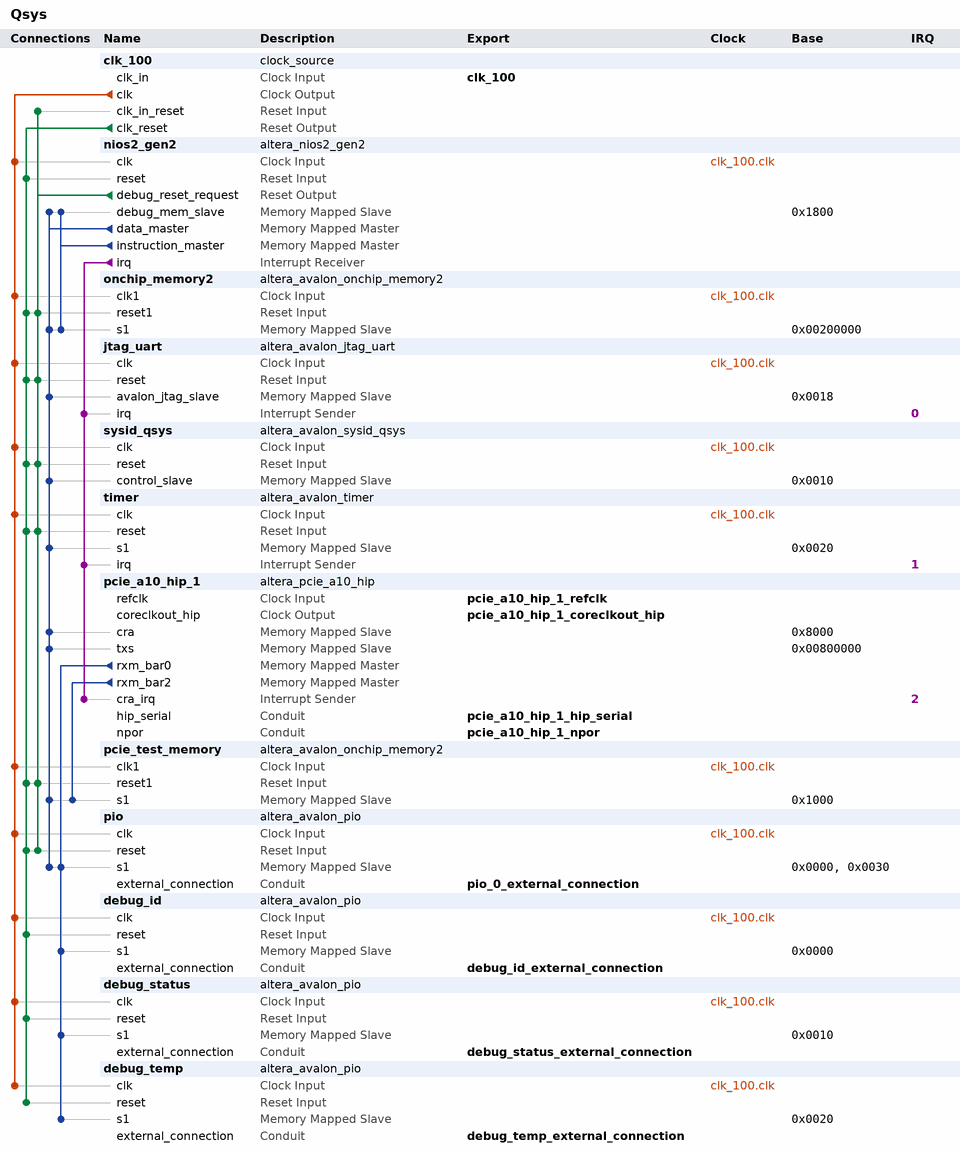
[diagram p0: system contents]
# Platform Designer (Qsys) system Qsys, Arria 10 10AX115N4F40E3SG
# Parameters at their usual value, and those the tool derives, are not listed.
package require -exact qsys 22.1
create_system Qsys
set_project_property DEVICE_FAMILY {Arria 10}
set_project_property DEVICE 10AX115N4F40E3SG

add_instance clk_100 clock_source 22.1
set_instance_parameter_value clk_100 clockFrequency 100000000

add_instance nios2_gen2 altera_nios2_gen2 22.1
set_instance_parameter_value nios2_gen2 dcache_size 2048
set_instance_parameter_value nios2_gen2 exceptionSlave onchip_memory2.s1
set_instance_parameter_value nios2_gen2 icache_size 4096
set_instance_parameter_value nios2_gen2 impl Fast
set_instance_parameter_value nios2_gen2 resetSlave onchip_memory2.s1
set_instance_parameter_value nios2_gen2 setting_support31bitdcachebypass false

add_instance onchip_memory2 altera_avalon_onchip_memory2 22.1
set_instance_parameter_value onchip_memory2 dataWidth 32
set_instance_parameter_value onchip_memory2 dualPort false
set_instance_parameter_value onchip_memory2 initMemContent true
set_instance_parameter_value onchip_memory2 initializationFileName onchip_mem.hex
set_instance_parameter_value onchip_memory2 memorySize 1048576

add_instance jtag_uart altera_avalon_jtag_uart 22.1
set_instance_parameter_value jtag_uart simInteractiveOptions NO_INTERACTIVE_WINDOWS

add_instance sysid_qsys altera_avalon_sysid_qsys 22.1
set_instance_parameter_value sysid_qsys id 305419896

add_instance timer altera_avalon_timer 22.1
set_instance_parameter_value timer period 1
set_instance_parameter_value timer periodUnits MSEC

add_instance pcie_a10_hip_1 altera_pcie_a10_hip 22.1
set_instance_parameter_value pcie_a10_hip_1 adme_enable_hwtcl 0
set_instance_parameter_value pcie_a10_hip_1 advance_error_reporting_hwtcl 0
set_instance_parameter_value pcie_a10_hip_1 apps_type_hwtcl 0
set_instance_parameter_value pcie_a10_hip_1 ari_support_hwtcl 0
set_instance_parameter_value pcie_a10_hip_1 ast_trs_num_desc_hwtcl 16
set_instance_parameter_value pcie_a10_hip_1 ast_trs_rxdata_width_hwtcl 256
set_instance_parameter_value pcie_a10_hip_1 ast_trs_rxdesc_width_hwtcl 256
set_instance_parameter_value pcie_a10_hip_1 ast_trs_rxmty_width_hwtcl 32
set_instance_parameter_value pcie_a10_hip_1 ast_trs_txdata_width_hwtcl 256
set_instance_parameter_value pcie_a10_hip_1 ast_trs_txdesc_width_hwtcl 256
set_instance_parameter_value pcie_a10_hip_1 ast_trs_txmty_width_hwtcl 32
set_instance_parameter_value pcie_a10_hip_1 ast_trs_txstatus_width_hwtcl 256
set_instance_parameter_value pcie_a10_hip_1 avmm_addr_width_hwtcl 64
set_instance_parameter_value pcie_a10_hip_1 bar0_address_width_hwtcl 16
set_instance_parameter_value pcie_a10_hip_1 bar0_type_hwtcl {64-bit prefetchable memory}
set_instance_parameter_value pcie_a10_hip_1 bar1_address_width_hwtcl 0
set_instance_parameter_value pcie_a10_hip_1 bar1_type_hwtcl Disabled
set_instance_parameter_value pcie_a10_hip_1 bar2_address_width_hwtcl 8
set_instance_parameter_value pcie_a10_hip_1 bar2_type_hwtcl {64-bit prefetchable memory}
set_instance_parameter_value pcie_a10_hip_1 bar3_address_width_hwtcl 0
set_instance_parameter_value pcie_a10_hip_1 bar3_type_hwtcl Disabled
set_instance_parameter_value pcie_a10_hip_1 base_device NIGHTFURY5
set_instance_parameter_value pcie_a10_hip_1 bfm_drive_interface_clk_hwtcl 1
set_instance_parameter_value pcie_a10_hip_1 bfm_drive_interface_control_hwtcl 1
set_instance_parameter_value pcie_a10_hip_1 bfm_drive_interface_npor_hwtcl 1
set_instance_parameter_value pcie_a10_hip_1 bfm_drive_interface_pipe_hwtcl 1
set_instance_parameter_value pcie_a10_hip_1 cg_a2p_addr_map_pass_thru_bits_hwtcl 12
set_instance_parameter_value pcie_a10_hip_1 cg_enable_a2p_interrupt_hwtcl 0
set_instance_parameter_value pcie_a10_hip_1 cg_enable_advanced_interrupt_hwtcl 0
set_instance_parameter_value pcie_a10_hip_1 class_code_hwtcl 16711680
set_instance_parameter_value pcie_a10_hip_1 completion_timeout_hwtcl NONE
set_instance_parameter_value pcie_a10_hip_1 cseb_autonomous_hwtcl 0
set_instance_parameter_value pcie_a10_hip_1 cseb_config_bypass_gui_hwtcl 0
set_instance_parameter_value pcie_a10_hip_1 design_environment_hwtcl QSYS
set_instance_parameter_value pcie_a10_hip_1 devhide_support_hwtcl 0
set_instance_parameter_value pcie_a10_hip_1 device_embedded_ep_support_hwtcl 0
set_instance_parameter_value pcie_a10_hip_1 device_id_hwtcl 57347
set_instance_parameter_value pcie_a10_hip_1 dis_adapt 0
set_instance_parameter_value pcie_a10_hip_1 dma_use_scfifo_ext_hwtcl 0
set_instance_parameter_value pcie_a10_hip_1 eco_fb332688_dis_hwtcl 0
set_instance_parameter_value pcie_a10_hip_1 ecrc_check_capable_hwtcl 0
set_instance_parameter_value pcie_a10_hip_1 ecrc_gen_capable_hwtcl 0
set_instance_parameter_value pcie_a10_hip_1 enable_alternate_link_list_hwtcl 0
set_instance_parameter_value pcie_a10_hip_1 enable_ast_trs_hwtcl 0
set_instance_parameter_value pcie_a10_hip_1 enable_avst_reset_hwtcl 1
set_instance_parameter_value pcie_a10_hip_1 enable_custom_features_hwtcl 0
set_instance_parameter_value pcie_a10_hip_1 enable_devkit_conduit_hwtcl 0
set_instance_parameter_value pcie_a10_hip_1 enable_example_design_qii_hwtcl 1
set_instance_parameter_value pcie_a10_hip_1 enable_example_design_sim_hwtcl 1
set_instance_parameter_value pcie_a10_hip_1 enable_example_design_synth_hwtcl 1
set_instance_parameter_value pcie_a10_hip_1 enable_example_design_tb_hwtcl 1
set_instance_parameter_value pcie_a10_hip_1 enable_g3_bypass_equlz_rp_sim_hwtcl 0
set_instance_parameter_value pcie_a10_hip_1 enable_gen3phase2eq_timechange 0
set_instance_parameter_value pcie_a10_hip_1 enable_hip_status_for_avmm_hwtcl 0
set_instance_parameter_value pcie_a10_hip_1 enable_lmi_hwtcl 0
set_instance_parameter_value pcie_a10_hip_1 enable_nobar_slection_hwtcl 0
set_instance_parameter_value pcie_a10_hip_1 enable_rxm_burst_hwtcl 0
set_instance_parameter_value pcie_a10_hip_1 enable_skp_det 0
set_instance_parameter_value pcie_a10_hip_1 enable_soft_dfe 0
set_instance_parameter_value pcie_a10_hip_1 export_fpll_output_to_top_level_hwtcl 0
set_instance_parameter_value pcie_a10_hip_1 export_phy_input_to_top_level_hwtcl 0
set_instance_parameter_value pcie_a10_hip_1 extended_tag_support_hwtcl 0
set_instance_parameter_value pcie_a10_hip_1 flr_capability_user_hwtcl 0
set_instance_parameter_value pcie_a10_hip_1 force_tag_checking_on_hwtcl 0
set_instance_parameter_value pcie_a10_hip_1 gen3_coeff_1_hwtcl 8
set_instance_parameter_value pcie_a10_hip_1 gen3_coeff_3_ber_meas_hwtcl 12ms
set_instance_parameter_value pcie_a10_hip_1 include_virtio_capabilities_hwtcl 0
set_instance_parameter_value pcie_a10_hip_1 interface_type_hwtcl Avalon-MM
set_instance_parameter_value pcie_a10_hip_1 internal_controller_hwtcl 1
set_instance_parameter_value pcie_a10_hip_1 link2csr_width_hwtcl 16
set_instance_parameter_value pcie_a10_hip_1 maximum_payload_size_hwtcl 128
set_instance_parameter_value pcie_a10_hip_1 part_trait_device 10AX115N4F40E3SG
set_instance_parameter_value pcie_a10_hip_1 pf0_ats_invalidate_queue_depth_hwtcl 0
set_instance_parameter_value pcie_a10_hip_1 pf0_bar0_prefetchable_hwtcl 1
set_instance_parameter_value pcie_a10_hip_1 pf0_bar0_present_hwtcl 1
set_instance_parameter_value pcie_a10_hip_1 pf0_bar0_size_hwtcl 12
set_instance_parameter_value pcie_a10_hip_1 pf0_bar0_type_hwtcl 1
set_instance_parameter_value pcie_a10_hip_1 pf0_bar1_prefetchable_hwtcl 1
set_instance_parameter_value pcie_a10_hip_1 pf0_bar1_present_hwtcl 0
set_instance_parameter_value pcie_a10_hip_1 pf0_bar1_size_hwtcl 12
set_instance_parameter_value pcie_a10_hip_1 pf0_bar2_prefetchable_hwtcl 1
set_instance_parameter_value pcie_a10_hip_1 pf0_bar2_present_hwtcl 0
set_instance_parameter_value pcie_a10_hip_1 pf0_bar2_size_hwtcl 12
set_instance_parameter_value pcie_a10_hip_1 pf0_bar2_type_hwtcl 1
set_instance_parameter_value pcie_a10_hip_1 pf0_bar3_prefetchable_hwtcl 1
set_instance_parameter_value pcie_a10_hip_1 pf0_bar3_present_hwtcl 0
set_instance_parameter_value pcie_a10_hip_1 pf0_bar3_size_hwtcl 12
set_instance_parameter_value pcie_a10_hip_1 pf0_bar4_prefetchable_hwtcl 1
set_instance_parameter_value pcie_a10_hip_1 pf0_bar4_present_hwtcl 0
set_instance_parameter_value pcie_a10_hip_1 pf0_bar4_size_hwtcl 12
set_instance_parameter_value pcie_a10_hip_1 pf0_bar4_type_hwtcl 1
set_instance_parameter_value pcie_a10_hip_1 pf0_bar5_prefetchable_hwtcl 1
set_instance_parameter_value pcie_a10_hip_1 pf0_bar5_present_hwtcl 0
set_instance_parameter_value pcie_a10_hip_1 pf0_bar5_size_hwtcl 12
set_instance_parameter_value pcie_a10_hip_1 pf0_exprom_bar_present_hwtcl 0
set_instance_parameter_value pcie_a10_hip_1 pf0_exprom_bar_size_hwtcl 12
set_instance_parameter_value pcie_a10_hip_1 pf0_extra_bar_present_hwtcl 0
set_instance_parameter_value pcie_a10_hip_1 pf0_extra_bar_size_hwtcl 12
set_instance_parameter_value pcie_a10_hip_1 pf0_interrupt_pin_hwtcl inta
set_instance_parameter_value pcie_a10_hip_1 pf0_intr_line_hwtcl 0
set_instance_parameter_value pcie_a10_hip_1 pf0_msi_multi_message_capable_hwtcl 4
set_instance_parameter_value pcie_a10_hip_1 pf0_msix_pba_bir_hwtcl 0
set_instance_parameter_value pcie_a10_hip_1 pf0_msix_pba_offset_hwtcl 0
set_instance_parameter_value pcie_a10_hip_1 pf0_msix_table_bir_hwtcl 0
set_instance_parameter_value pcie_a10_hip_1 pf0_msix_table_offset_hwtcl 0
set_instance_parameter_value pcie_a10_hip_1 pf0_msix_table_size_hwtcl 0
set_instance_parameter_value pcie_a10_hip_1 pf0_pci_prog_intfc_byte_hwtcl 0
set_instance_parameter_value pcie_a10_hip_1 pf0_subclass_code_hwtcl 0
set_instance_parameter_value pcie_a10_hip_1 pf0_tph_dev_specific_mode_support_hwtcl 0
set_instance_parameter_value pcie_a10_hip_1 pf0_tph_int_mode_support_hwtcl 0
set_instance_parameter_value pcie_a10_hip_1 pf0_tph_st_table_location_hwtcl 0
set_instance_parameter_value pcie_a10_hip_1 pf0_tph_st_table_size_hwtcl 63
set_instance_parameter_value pcie_a10_hip_1 pf0_vf_bar0_prefetchable_hwtcl 1
set_instance_parameter_value pcie_a10_hip_1 pf0_vf_bar0_present_hwtcl 0
set_instance_parameter_value pcie_a10_hip_1 pf0_vf_bar0_size_hwtcl 12
set_instance_parameter_value pcie_a10_hip_1 pf0_vf_bar0_type_hwtcl 1
set_instance_parameter_value pcie_a10_hip_1 pf0_vf_bar1_prefetchable_hwtcl 1
set_instance_parameter_value pcie_a10_hip_1 pf0_vf_bar1_present_hwtcl 0
set_instance_parameter_value pcie_a10_hip_1 pf0_vf_bar1_size_hwtcl 12
set_instance_parameter_value pcie_a10_hip_1 pf0_vf_bar2_prefetchable_hwtcl 1
set_instance_parameter_value pcie_a10_hip_1 pf0_vf_bar2_present_hwtcl 0
set_instance_parameter_value pcie_a10_hip_1 pf0_vf_bar2_size_hwtcl 12
set_instance_parameter_value pcie_a10_hip_1 pf0_vf_bar2_type_hwtcl 1
set_instance_parameter_value pcie_a10_hip_1 pf0_vf_bar3_prefetchable_hwtcl 1
set_instance_parameter_value pcie_a10_hip_1 pf0_vf_bar3_present_hwtcl 0
set_instance_parameter_value pcie_a10_hip_1 pf0_vf_bar3_size_hwtcl 12
set_instance_parameter_value pcie_a10_hip_1 pf0_vf_bar4_prefetchable_hwtcl 1
set_instance_parameter_value pcie_a10_hip_1 pf0_vf_bar4_present_hwtcl 0
set_instance_parameter_value pcie_a10_hip_1 pf0_vf_bar4_size_hwtcl 12
set_instance_parameter_value pcie_a10_hip_1 pf0_vf_bar4_type_hwtcl 1
set_instance_parameter_value pcie_a10_hip_1 pf0_vf_bar5_prefetchable_hwtcl 1
set_instance_parameter_value pcie_a10_hip_1 pf0_vf_bar5_present_hwtcl 0
set_instance_parameter_value pcie_a10_hip_1 pf0_vf_bar5_size_hwtcl 12
set_instance_parameter_value pcie_a10_hip_1 pf0_vf_count_user_hwtcl 0
set_instance_parameter_value pcie_a10_hip_1 pf0_vf_device_id_hwtcl 0
set_instance_parameter_value pcie_a10_hip_1 pf0_vf_msix_pba_bir_hwtcl 0
set_instance_parameter_value pcie_a10_hip_1 pf0_vf_msix_pba_offset_hwtcl 0
set_instance_parameter_value pcie_a10_hip_1 pf0_vf_msix_tbl_bir_hwtcl 0
set_instance_parameter_value pcie_a10_hip_1 pf0_vf_msix_tbl_offset_hwtcl 0
set_instance_parameter_value pcie_a10_hip_1 pf0_vf_msix_tbl_size_hwtcl 0
set_instance_parameter_value pcie_a10_hip_1 pf0_vf_subsystem_device_id_hwtcl 0
set_instance_parameter_value pcie_a10_hip_1 pf0_vf_tph_dev_specific_mode_support_hwtcl 0
set_instance_parameter_value pcie_a10_hip_1 pf0_vf_tph_int_mode_support_hwtcl 0
set_instance_parameter_value pcie_a10_hip_1 pf0_vf_tph_st_table_location_hwtcl 0
set_instance_parameter_value pcie_a10_hip_1 pf0_vf_tph_st_table_size_hwtcl 63
set_instance_parameter_value pcie_a10_hip_1 pf0_virtio_capability_present_hwtcl 0
set_instance_parameter_value pcie_a10_hip_1 pf0_virtio_cmn_config_bar_indicator_hwtcl 0
set_instance_parameter_value pcie_a10_hip_1 pf0_virtio_cmn_config_bar_offset_hwtcl 0
set_instance_parameter_value pcie_a10_hip_1 pf0_virtio_cmn_config_structure_length_hwtcl 0
set_instance_parameter_value pcie_a10_hip_1 pf0_virtio_device_specific_cap_present_hwtcl 0
set_instance_parameter_value pcie_a10_hip_1 pf0_virtio_devspecific_bar_indicator_hwtcl 0
set_instance_parameter_value pcie_a10_hip_1 pf0_virtio_devspecific_bar_offset_hwtcl 0
set_instance_parameter_value pcie_a10_hip_1 pf0_virtio_devspecific_structure_length_hwtcl 0
set_instance_parameter_value pcie_a10_hip_1 pf0_virtio_isrstatus_bar_indicator_hwtcl 0
set_instance_parameter_value pcie_a10_hip_1 pf0_virtio_isrstatus_bar_offset_hwtcl 0
set_instance_parameter_value pcie_a10_hip_1 pf0_virtio_isrstatus_structure_length_hwtcl 0
set_instance_parameter_value pcie_a10_hip_1 pf0_virtio_notification_bar_indicator_hwtcl 0
set_instance_parameter_value pcie_a10_hip_1 pf0_virtio_notification_bar_offset_hwtcl 0
set_instance_parameter_value pcie_a10_hip_1 pf0_virtio_notification_structure_length_hwtcl 0
set_instance_parameter_value pcie_a10_hip_1 pf0_virtio_notify_off_multiplier_hwtcl 0
set_instance_parameter_value pcie_a10_hip_1 pf0_virtio_pciconfig_access_bar_indicator_hwtcl 0
set_instance_parameter_value pcie_a10_hip_1 pf0_virtio_pciconfig_access_bar_offset_hwtcl 0
set_instance_parameter_value pcie_a10_hip_1 pf0_virtio_pciconfig_access_structure_length_hwtcl 0
set_instance_parameter_value pcie_a10_hip_1 pf0vf_virtio_capability_present_hwtcl 0
set_instance_parameter_value pcie_a10_hip_1 pf0vf_virtio_cmn_config_bar_indicator_hwtcl 0
set_instance_parameter_value pcie_a10_hip_1 pf0vf_virtio_cmn_config_bar_offset_hwtcl 0
set_instance_parameter_value pcie_a10_hip_1 pf0vf_virtio_cmn_config_structure_length_hwtcl 0
set_instance_parameter_value pcie_a10_hip_1 pf0vf_virtio_device_specific_cap_present_hwtcl 0
set_instance_parameter_value pcie_a10_hip_1 pf0vf_virtio_devspecific_bar_indicator_hwtcl 0
set_instance_parameter_value pcie_a10_hip_1 pf0vf_virtio_devspecific_bar_offset_hwtcl 0
set_instance_parameter_value pcie_a10_hip_1 pf0vf_virtio_devspecific_structure_length_hwtcl 0
set_instance_parameter_value pcie_a10_hip_1 pf0vf_virtio_isrstatus_bar_indicator_hwtcl 0
set_instance_parameter_value pcie_a10_hip_1 pf0vf_virtio_isrstatus_bar_offset_hwtcl 0
set_instance_parameter_value pcie_a10_hip_1 pf0vf_virtio_isrstatus_structure_length_hwtcl 0
set_instance_parameter_value pcie_a10_hip_1 pf0vf_virtio_notification_bar_indicator_hwtcl 0
set_instance_parameter_value pcie_a10_hip_1 pf0vf_virtio_notification_bar_offset_hwtcl 0
set_instance_parameter_value pcie_a10_hip_1 pf0vf_virtio_notification_structure_length_hwtcl 0
set_instance_parameter_value pcie_a10_hip_1 pf0vf_virtio_notify_off_multiplier_hwtcl 0
set_instance_parameter_value pcie_a10_hip_1 pf0vf_virtio_pciconfig_access_bar_indicator_hwtcl 0
set_instance_parameter_value pcie_a10_hip_1 pf0vf_virtio_pciconfig_access_bar_offset_hwtcl 0
set_instance_parameter_value pcie_a10_hip_1 pf0vf_virtio_pciconfig_access_structure_length_hwtcl 0
set_instance_parameter_value pcie_a10_hip_1 pf1_ats_invalidate_queue_depth_hwtcl 0
set_instance_parameter_value pcie_a10_hip_1 pf1_bar0_prefetchable_hwtcl 1
set_instance_parameter_value pcie_a10_hip_1 pf1_bar0_present_hwtcl 0
set_instance_parameter_value pcie_a10_hip_1 pf1_bar0_size_hwtcl 12
set_instance_parameter_value pcie_a10_hip_1 pf1_bar0_type_hwtcl 1
set_instance_parameter_value pcie_a10_hip_1 pf1_bar1_prefetchable_hwtcl 1
set_instance_parameter_value pcie_a10_hip_1 pf1_bar1_present_hwtcl 0
set_instance_parameter_value pcie_a10_hip_1 pf1_bar1_size_hwtcl 12
set_instance_parameter_value pcie_a10_hip_1 pf1_bar2_prefetchable_hwtcl 1
set_instance_parameter_value pcie_a10_hip_1 pf1_bar2_present_hwtcl 0
set_instance_parameter_value pcie_a10_hip_1 pf1_bar2_size_hwtcl 12
set_instance_parameter_value pcie_a10_hip_1 pf1_bar2_type_hwtcl 1
set_instance_parameter_value pcie_a10_hip_1 pf1_bar3_prefetchable_hwtcl 1
set_instance_parameter_value pcie_a10_hip_1 pf1_bar3_present_hwtcl 0
set_instance_parameter_value pcie_a10_hip_1 pf1_bar3_size_hwtcl 12
set_instance_parameter_value pcie_a10_hip_1 pf1_bar4_prefetchable_hwtcl 1
set_instance_parameter_value pcie_a10_hip_1 pf1_bar4_present_hwtcl 0
set_instance_parameter_value pcie_a10_hip_1 pf1_bar4_size_hwtcl 12
set_instance_parameter_value pcie_a10_hip_1 pf1_bar4_type_hwtcl 1
set_instance_parameter_value pcie_a10_hip_1 pf1_bar5_prefetchable_hwtcl 1
set_instance_parameter_value pcie_a10_hip_1 pf1_bar5_present_hwtcl 0
set_instance_parameter_value pcie_a10_hip_1 pf1_bar5_size_hwtcl 12
set_instance_parameter_value pcie_a10_hip_1 pf1_class_code_hwtcl 0
set_instance_parameter_value pcie_a10_hip_1 pf1_device_id_hwtcl 0
set_instance_parameter_value pcie_a10_hip_1 pf1_exprom_bar_present_hwtcl 0
set_instance_parameter_value pcie_a10_hip_1 pf1_exprom_bar_size_hwtcl 12
set_instance_parameter_value pcie_a10_hip_1 pf1_interrupt_pin_hwtcl inta
set_instance_parameter_value pcie_a10_hip_1 pf1_intr_line_hwtcl 0
set_instance_parameter_value pcie_a10_hip_1 pf1_msi_multi_message_capable_hwtcl 4
set_instance_parameter_value pcie_a10_hip_1 pf1_msix_pba_bir_hwtcl 0
set_instance_parameter_value pcie_a10_hip_1 pf1_msix_pba_offset_hwtcl 0
set_instance_parameter_value pcie_a10_hip_1 pf1_msix_table_bir_hwtcl 0
set_instance_parameter_value pcie_a10_hip_1 pf1_msix_table_offset_hwtcl 0
set_instance_parameter_value pcie_a10_hip_1 pf1_msix_table_size_hwtcl 0
set_instance_parameter_value pcie_a10_hip_1 pf1_pci_prog_intfc_byte_hwtcl 0
set_instance_parameter_value pcie_a10_hip_1 pf1_revision_id_hwtcl 0
set_instance_parameter_value pcie_a10_hip_1 pf1_subclass_code_hwtcl 0
set_instance_parameter_value pcie_a10_hip_1 pf1_subsystem_device_id_hwtcl 0
set_instance_parameter_value pcie_a10_hip_1 pf1_subsystem_vendor_id_hwtcl 0
set_instance_parameter_value pcie_a10_hip_1 pf1_tph_dev_specific_mode_support_hwtcl 0
set_instance_parameter_value pcie_a10_hip_1 pf1_tph_int_mode_support_hwtcl 0
set_instance_parameter_value pcie_a10_hip_1 pf1_tph_st_table_location_hwtcl 0
set_instance_parameter_value pcie_a10_hip_1 pf1_tph_st_table_size_hwtcl 63
set_instance_parameter_value pcie_a10_hip_1 pf1_vendor_id_hwtcl 0
set_instance_parameter_value pcie_a10_hip_1 pf1_vf_bar0_prefetchable_hwtcl 1
set_instance_parameter_value pcie_a10_hip_1 pf1_vf_bar0_present_hwtcl 0
set_instance_parameter_value pcie_a10_hip_1 pf1_vf_bar0_size_hwtcl 12
set_instance_parameter_value pcie_a10_hip_1 pf1_vf_bar0_type_hwtcl 1
set_instance_parameter_value pcie_a10_hip_1 pf1_vf_bar1_prefetchable_hwtcl 1
set_instance_parameter_value pcie_a10_hip_1 pf1_vf_bar1_present_hwtcl 0
set_instance_parameter_value pcie_a10_hip_1 pf1_vf_bar1_size_hwtcl 12
set_instance_parameter_value pcie_a10_hip_1 pf1_vf_bar2_prefetchable_hwtcl 1
set_instance_parameter_value pcie_a10_hip_1 pf1_vf_bar2_present_hwtcl 0
set_instance_parameter_value pcie_a10_hip_1 pf1_vf_bar2_size_hwtcl 12
set_instance_parameter_value pcie_a10_hip_1 pf1_vf_bar2_type_hwtcl 1
set_instance_parameter_value pcie_a10_hip_1 pf1_vf_bar3_prefetchable_hwtcl 1
set_instance_parameter_value pcie_a10_hip_1 pf1_vf_bar3_present_hwtcl 0
set_instance_parameter_value pcie_a10_hip_1 pf1_vf_bar3_size_hwtcl 12
set_instance_parameter_value pcie_a10_hip_1 pf1_vf_bar4_prefetchable_hwtcl 1
set_instance_parameter_value pcie_a10_hip_1 pf1_vf_bar4_present_hwtcl 0
set_instance_parameter_value pcie_a10_hip_1 pf1_vf_bar4_size_hwtcl 12
set_instance_parameter_value pcie_a10_hip_1 pf1_vf_bar4_type_hwtcl 1
set_instance_parameter_value pcie_a10_hip_1 pf1_vf_bar5_prefetchable_hwtcl 1
set_instance_parameter_value pcie_a10_hip_1 pf1_vf_bar5_present_hwtcl 0
set_instance_parameter_value pcie_a10_hip_1 pf1_vf_bar5_size_hwtcl 12
set_instance_parameter_value pcie_a10_hip_1 pf1_vf_count_user_hwtcl 0
set_instance_parameter_value pcie_a10_hip_1 pf1_vf_device_id_hwtcl 0
set_instance_parameter_value pcie_a10_hip_1 pf1_vf_msix_pba_bir_hwtcl 0
set_instance_parameter_value pcie_a10_hip_1 pf1_vf_msix_pba_offset_hwtcl 0
set_instance_parameter_value pcie_a10_hip_1 pf1_vf_msix_tbl_bir_hwtcl 0
set_instance_parameter_value pcie_a10_hip_1 pf1_vf_msix_tbl_offset_hwtcl 0
set_instance_parameter_value pcie_a10_hip_1 pf1_vf_msix_tbl_size_hwtcl 0
set_instance_parameter_value pcie_a10_hip_1 pf1_vf_subsystem_device_id_hwtcl 0
set_instance_parameter_value pcie_a10_hip_1 pf1_vf_tph_dev_specific_mode_support_hwtcl 0
set_instance_parameter_value pcie_a10_hip_1 pf1_vf_tph_int_mode_support_hwtcl 0
set_instance_parameter_value pcie_a10_hip_1 pf1_vf_tph_st_table_location_hwtcl 0
set_instance_parameter_value pcie_a10_hip_1 pf1_vf_tph_st_table_size_hwtcl 63
set_instance_parameter_value pcie_a10_hip_1 pf1_virtio_capability_present_hwtcl 0
set_instance_parameter_value pcie_a10_hip_1 pf1_virtio_cmn_config_bar_indicator_hwtcl 0
set_instance_parameter_value pcie_a10_hip_1 pf1_virtio_cmn_config_bar_offset_hwtcl 0
set_instance_parameter_value pcie_a10_hip_1 pf1_virtio_cmn_config_structure_length_hwtcl 0
set_instance_parameter_value pcie_a10_hip_1 pf1_virtio_device_specific_cap_present_hwtcl 0
set_instance_parameter_value pcie_a10_hip_1 pf1_virtio_devspecific_bar_indicator_hwtcl 0
set_instance_parameter_value pcie_a10_hip_1 pf1_virtio_devspecific_bar_offset_hwtcl 0
set_instance_parameter_value pcie_a10_hip_1 pf1_virtio_devspecific_structure_length_hwtcl 0
set_instance_parameter_value pcie_a10_hip_1 pf1_virtio_isrstatus_bar_indicator_hwtcl 0
set_instance_parameter_value pcie_a10_hip_1 pf1_virtio_isrstatus_bar_offset_hwtcl 0
set_instance_parameter_value pcie_a10_hip_1 pf1_virtio_isrstatus_structure_length_hwtcl 0
set_instance_parameter_value pcie_a10_hip_1 pf1_virtio_notification_bar_indicator_hwtcl 0
set_instance_parameter_value pcie_a10_hip_1 pf1_virtio_notification_bar_offset_hwtcl 0
set_instance_parameter_value pcie_a10_hip_1 pf1_virtio_notification_structure_length_hwtcl 0
set_instance_parameter_value pcie_a10_hip_1 pf1_virtio_notify_off_multiplier_hwtcl 0
set_instance_parameter_value pcie_a10_hip_1 pf1_virtio_pciconfig_access_bar_indicator_hwtcl 0
set_instance_parameter_value pcie_a10_hip_1 pf1_virtio_pciconfig_access_bar_offset_hwtcl 0
set_instance_parameter_value pcie_a10_hip_1 pf1_virtio_pciconfig_access_structure_length_hwtcl 0
set_instance_parameter_value pcie_a10_hip_1 pf1vf_virtio_capability_present_hwtcl 0
set_instance_parameter_value pcie_a10_hip_1 pf1vf_virtio_cmn_config_bar_indicator_hwtcl 0
set_instance_parameter_value pcie_a10_hip_1 pf1vf_virtio_cmn_config_bar_offset_hwtcl 0
set_instance_parameter_value pcie_a10_hip_1 pf1vf_virtio_cmn_config_structure_length_hwtcl 0
set_instance_parameter_value pcie_a10_hip_1 pf1vf_virtio_device_specific_cap_present_hwtcl 0
set_instance_parameter_value pcie_a10_hip_1 pf1vf_virtio_devspecific_bar_indicator_hwtcl 0
set_instance_parameter_value pcie_a10_hip_1 pf1vf_virtio_devspecific_bar_offset_hwtcl 0
set_instance_parameter_value pcie_a10_hip_1 pf1vf_virtio_devspecific_structure_length_hwtcl 0
set_instance_parameter_value pcie_a10_hip_1 pf1vf_virtio_isrstatus_bar_indicator_hwtcl 0
set_instance_parameter_value pcie_a10_hip_1 pf1vf_virtio_isrstatus_bar_offset_hwtcl 0
set_instance_parameter_value pcie_a10_hip_1 pf1vf_virtio_isrstatus_structure_length_hwtcl 0
set_instance_parameter_value pcie_a10_hip_1 pf1vf_virtio_notification_bar_indicator_hwtcl 0
set_instance_parameter_value pcie_a10_hip_1 pf1vf_virtio_notification_bar_offset_hwtcl 0
set_instance_parameter_value pcie_a10_hip_1 pf1vf_virtio_notification_structure_length_hwtcl 0
set_instance_parameter_value pcie_a10_hip_1 pf1vf_virtio_notify_off_multiplier_hwtcl 0
set_instance_parameter_value pcie_a10_hip_1 pf1vf_virtio_pciconfig_access_bar_indicator_hwtcl 0
set_instance_parameter_value pcie_a10_hip_1 pf1vf_virtio_pciconfig_access_bar_offset_hwtcl 0
set_instance_parameter_value pcie_a10_hip_1 pf1vf_virtio_pciconfig_access_structure_length_hwtcl 0
set_instance_parameter_value pcie_a10_hip_1 pf2_ats_invalidate_queue_depth_hwtcl 0
set_instance_parameter_value pcie_a10_hip_1 pf2_bar0_prefetchable_hwtcl 1
set_instance_parameter_value pcie_a10_hip_1 pf2_bar0_present_hwtcl 0
set_instance_parameter_value pcie_a10_hip_1 pf2_bar0_size_hwtcl 12
set_instance_parameter_value pcie_a10_hip_1 pf2_bar0_type_hwtcl 1
set_instance_parameter_value pcie_a10_hip_1 pf2_bar1_prefetchable_hwtcl 1
set_instance_parameter_value pcie_a10_hip_1 pf2_bar1_present_hwtcl 0
set_instance_parameter_value pcie_a10_hip_1 pf2_bar1_size_hwtcl 12
set_instance_parameter_value pcie_a10_hip_1 pf2_bar2_prefetchable_hwtcl 1
set_instance_parameter_value pcie_a10_hip_1 pf2_bar2_present_hwtcl 0
set_instance_parameter_value pcie_a10_hip_1 pf2_bar2_size_hwtcl 12
set_instance_parameter_value pcie_a10_hip_1 pf2_bar2_type_hwtcl 1
set_instance_parameter_value pcie_a10_hip_1 pf2_bar3_prefetchable_hwtcl 1
set_instance_parameter_value pcie_a10_hip_1 pf2_bar3_present_hwtcl 0
set_instance_parameter_value pcie_a10_hip_1 pf2_bar3_size_hwtcl 12
set_instance_parameter_value pcie_a10_hip_1 pf2_bar4_prefetchable_hwtcl 1
set_instance_parameter_value pcie_a10_hip_1 pf2_bar4_present_hwtcl 0
set_instance_parameter_value pcie_a10_hip_1 pf2_bar4_size_hwtcl 12
set_instance_parameter_value pcie_a10_hip_1 pf2_bar4_type_hwtcl 1
set_instance_parameter_value pcie_a10_hip_1 pf2_bar5_prefetchable_hwtcl 1
set_instance_parameter_value pcie_a10_hip_1 pf2_bar5_present_hwtcl 0
set_instance_parameter_value pcie_a10_hip_1 pf2_bar5_size_hwtcl 12
set_instance_parameter_value pcie_a10_hip_1 pf2_class_code_hwtcl 0
set_instance_parameter_value pcie_a10_hip_1 pf2_device_id_hwtcl 0
set_instance_parameter_value pcie_a10_hip_1 pf2_exprom_bar_present_hwtcl 0
set_instance_parameter_value pcie_a10_hip_1 pf2_exprom_bar_size_hwtcl 12
set_instance_parameter_value pcie_a10_hip_1 pf2_interrupt_pin_hwtcl inta
set_instance_parameter_value pcie_a10_hip_1 pf2_intr_line_hwtcl 0
set_instance_parameter_value pcie_a10_hip_1 pf2_msi_multi_message_capable_hwtcl 4
set_instance_parameter_value pcie_a10_hip_1 pf2_msix_pba_bir_hwtcl 0
set_instance_parameter_value pcie_a10_hip_1 pf2_msix_pba_offset_hwtcl 0
set_instance_parameter_value pcie_a10_hip_1 pf2_msix_table_bir_hwtcl 0
set_instance_parameter_value pcie_a10_hip_1 pf2_msix_table_offset_hwtcl 0
set_instance_parameter_value pcie_a10_hip_1 pf2_msix_table_size_hwtcl 0
set_instance_parameter_value pcie_a10_hip_1 pf2_pci_prog_intfc_byte_hwtcl 0
set_instance_parameter_value pcie_a10_hip_1 pf2_revision_id_hwtcl 0
set_instance_parameter_value pcie_a10_hip_1 pf2_subclass_code_hwtcl 0
set_instance_parameter_value pcie_a10_hip_1 pf2_subsystem_device_id_hwtcl 0
set_instance_parameter_value pcie_a10_hip_1 pf2_subsystem_vendor_id_hwtcl 0
set_instance_parameter_value pcie_a10_hip_1 pf2_tph_dev_specific_mode_support_hwtcl 0
set_instance_parameter_value pcie_a10_hip_1 pf2_tph_int_mode_support_hwtcl 0
set_instance_parameter_value pcie_a10_hip_1 pf2_tph_st_table_location_hwtcl 0
set_instance_parameter_value pcie_a10_hip_1 pf2_tph_st_table_size_hwtcl 63
set_instance_parameter_value pcie_a10_hip_1 pf2_vendor_id_hwtcl 0
set_instance_parameter_value pcie_a10_hip_1 pf2_vf_bar0_prefetchable_hwtcl 1
set_instance_parameter_value pcie_a10_hip_1 pf2_vf_bar0_present_hwtcl 0
set_instance_parameter_value pcie_a10_hip_1 pf2_vf_bar0_size_hwtcl 12
set_instance_parameter_value pcie_a10_hip_1 pf2_vf_bar0_type_hwtcl 1
set_instance_parameter_value pcie_a10_hip_1 pf2_vf_bar1_prefetchable_hwtcl 1
set_instance_parameter_value pcie_a10_hip_1 pf2_vf_bar1_present_hwtcl 0
set_instance_parameter_value pcie_a10_hip_1 pf2_vf_bar1_size_hwtcl 12
set_instance_parameter_value pcie_a10_hip_1 pf2_vf_bar2_prefetchable_hwtcl 1
set_instance_parameter_value pcie_a10_hip_1 pf2_vf_bar2_present_hwtcl 0
set_instance_parameter_value pcie_a10_hip_1 pf2_vf_bar2_size_hwtcl 12
set_instance_parameter_value pcie_a10_hip_1 pf2_vf_bar2_type_hwtcl 1
set_instance_parameter_value pcie_a10_hip_1 pf2_vf_bar3_prefetchable_hwtcl 1
set_instance_parameter_value pcie_a10_hip_1 pf2_vf_bar3_present_hwtcl 0
set_instance_parameter_value pcie_a10_hip_1 pf2_vf_bar3_size_hwtcl 12
set_instance_parameter_value pcie_a10_hip_1 pf2_vf_bar4_prefetchable_hwtcl 1
set_instance_parameter_value pcie_a10_hip_1 pf2_vf_bar4_present_hwtcl 0
set_instance_parameter_value pcie_a10_hip_1 pf2_vf_bar4_size_hwtcl 12
set_instance_parameter_value pcie_a10_hip_1 pf2_vf_bar4_type_hwtcl 1
set_instance_parameter_value pcie_a10_hip_1 pf2_vf_bar5_prefetchable_hwtcl 1
set_instance_parameter_value pcie_a10_hip_1 pf2_vf_bar5_present_hwtcl 0
set_instance_parameter_value pcie_a10_hip_1 pf2_vf_bar5_size_hwtcl 12
set_instance_parameter_value pcie_a10_hip_1 pf2_vf_count_user_hwtcl 0
set_instance_parameter_value pcie_a10_hip_1 pf2_vf_device_id_hwtcl 0
set_instance_parameter_value pcie_a10_hip_1 pf2_vf_msix_pba_bir_hwtcl 0
set_instance_parameter_value pcie_a10_hip_1 pf2_vf_msix_pba_offset_hwtcl 0
set_instance_parameter_value pcie_a10_hip_1 pf2_vf_msix_tbl_bir_hwtcl 0
set_instance_parameter_value pcie_a10_hip_1 pf2_vf_msix_tbl_offset_hwtcl 0
set_instance_parameter_value pcie_a10_hip_1 pf2_vf_msix_tbl_size_hwtcl 0
set_instance_parameter_value pcie_a10_hip_1 pf2_vf_subsystem_device_id_hwtcl 0
set_instance_parameter_value pcie_a10_hip_1 pf2_vf_tph_dev_specific_mode_support_hwtcl 0
set_instance_parameter_value pcie_a10_hip_1 pf2_vf_tph_int_mode_support_hwtcl 0
set_instance_parameter_value pcie_a10_hip_1 pf2_vf_tph_st_table_location_hwtcl 0
set_instance_parameter_value pcie_a10_hip_1 pf2_vf_tph_st_table_size_hwtcl 63
set_instance_parameter_value pcie_a10_hip_1 pf2_virtio_capability_present_hwtcl 0
set_instance_parameter_value pcie_a10_hip_1 pf2_virtio_cmn_config_bar_indicator_hwtcl 0
set_instance_parameter_value pcie_a10_hip_1 pf2_virtio_cmn_config_bar_offset_hwtcl 0
set_instance_parameter_value pcie_a10_hip_1 pf2_virtio_cmn_config_structure_length_hwtcl 0
set_instance_parameter_value pcie_a10_hip_1 pf2_virtio_device_specific_cap_present_hwtcl 0
set_instance_parameter_value pcie_a10_hip_1 pf2_virtio_devspecific_bar_indicator_hwtcl 0
set_instance_parameter_value pcie_a10_hip_1 pf2_virtio_devspecific_bar_offset_hwtcl 0
set_instance_parameter_value pcie_a10_hip_1 pf2_virtio_devspecific_structure_length_hwtcl 0
set_instance_parameter_value pcie_a10_hip_1 pf2_virtio_isrstatus_bar_indicator_hwtcl 0
set_instance_parameter_value pcie_a10_hip_1 pf2_virtio_isrstatus_bar_offset_hwtcl 0
set_instance_parameter_value pcie_a10_hip_1 pf2_virtio_isrstatus_structure_length_hwtcl 0
set_instance_parameter_value pcie_a10_hip_1 pf2_virtio_notification_bar_indicator_hwtcl 0
set_instance_parameter_value pcie_a10_hip_1 pf2_virtio_notification_bar_offset_hwtcl 0
set_instance_parameter_value pcie_a10_hip_1 pf2_virtio_notification_structure_length_hwtcl 0
set_instance_parameter_value pcie_a10_hip_1 pf2_virtio_notify_off_multiplier_hwtcl 0
set_instance_parameter_value pcie_a10_hip_1 pf2_virtio_pciconfig_access_bar_indicator_hwtcl 0
set_instance_parameter_value pcie_a10_hip_1 pf2_virtio_pciconfig_access_bar_offset_hwtcl 0
set_instance_parameter_value pcie_a10_hip_1 pf2_virtio_pciconfig_access_structure_length_hwtcl 0
set_instance_parameter_value pcie_a10_hip_1 pf2vf_virtio_capability_present_hwtcl 0
set_instance_parameter_value pcie_a10_hip_1 pf2vf_virtio_cmn_config_bar_indicator_hwtcl 0
set_instance_parameter_value pcie_a10_hip_1 pf2vf_virtio_cmn_config_bar_offset_hwtcl 0
set_instance_parameter_value pcie_a10_hip_1 pf2vf_virtio_cmn_config_structure_length_hwtcl 0
set_instance_parameter_value pcie_a10_hip_1 pf2vf_virtio_device_specific_cap_present_hwtcl 0
set_instance_parameter_value pcie_a10_hip_1 pf2vf_virtio_devspecific_bar_indicator_hwtcl 0
set_instance_parameter_value pcie_a10_hip_1 pf2vf_virtio_devspecific_bar_offset_hwtcl 0
set_instance_parameter_value pcie_a10_hip_1 pf2vf_virtio_devspecific_structure_length_hwtcl 0
set_instance_parameter_value pcie_a10_hip_1 pf2vf_virtio_isrstatus_bar_indicator_hwtcl 0
set_instance_parameter_value pcie_a10_hip_1 pf2vf_virtio_isrstatus_bar_offset_hwtcl 0
set_instance_parameter_value pcie_a10_hip_1 pf2vf_virtio_isrstatus_structure_length_hwtcl 0
set_instance_parameter_value pcie_a10_hip_1 pf2vf_virtio_notification_bar_indicator_hwtcl 0
set_instance_parameter_value pcie_a10_hip_1 pf2vf_virtio_notification_bar_offset_hwtcl 0
set_instance_parameter_value pcie_a10_hip_1 pf2vf_virtio_notification_structure_length_hwtcl 0
set_instance_parameter_value pcie_a10_hip_1 pf2vf_virtio_notify_off_multiplier_hwtcl 0
set_instance_parameter_value pcie_a10_hip_1 pf2vf_virtio_pciconfig_access_bar_indicator_hwtcl 0
set_instance_parameter_value pcie_a10_hip_1 pf2vf_virtio_pciconfig_access_bar_offset_hwtcl 0
set_instance_parameter_value pcie_a10_hip_1 pf2vf_virtio_pciconfig_access_structure_length_hwtcl 0
set_instance_parameter_value pcie_a10_hip_1 pf3_ats_invalidate_queue_depth_hwtcl 0
set_instance_parameter_value pcie_a10_hip_1 pf3_bar0_prefetchable_hwtcl 1
set_instance_parameter_value pcie_a10_hip_1 pf3_bar0_present_hwtcl 0
set_instance_parameter_value pcie_a10_hip_1 pf3_bar0_size_hwtcl 12
set_instance_parameter_value pcie_a10_hip_1 pf3_bar0_type_hwtcl 1
set_instance_parameter_value pcie_a10_hip_1 pf3_bar1_prefetchable_hwtcl 1
set_instance_parameter_value pcie_a10_hip_1 pf3_bar1_present_hwtcl 0
set_instance_parameter_value pcie_a10_hip_1 pf3_bar1_size_hwtcl 12
set_instance_parameter_value pcie_a10_hip_1 pf3_bar2_prefetchable_hwtcl 1
set_instance_parameter_value pcie_a10_hip_1 pf3_bar2_present_hwtcl 0
set_instance_parameter_value pcie_a10_hip_1 pf3_bar2_size_hwtcl 12
set_instance_parameter_value pcie_a10_hip_1 pf3_bar2_type_hwtcl 1
set_instance_parameter_value pcie_a10_hip_1 pf3_bar3_prefetchable_hwtcl 1
set_instance_parameter_value pcie_a10_hip_1 pf3_bar3_present_hwtcl 0
set_instance_parameter_value pcie_a10_hip_1 pf3_bar3_size_hwtcl 12
set_instance_parameter_value pcie_a10_hip_1 pf3_bar4_prefetchable_hwtcl 1
set_instance_parameter_value pcie_a10_hip_1 pf3_bar4_present_hwtcl 0
set_instance_parameter_value pcie_a10_hip_1 pf3_bar4_size_hwtcl 12
set_instance_parameter_value pcie_a10_hip_1 pf3_bar4_type_hwtcl 1
set_instance_parameter_value pcie_a10_hip_1 pf3_bar5_prefetchable_hwtcl 1
set_instance_parameter_value pcie_a10_hip_1 pf3_bar5_present_hwtcl 0
set_instance_parameter_value pcie_a10_hip_1 pf3_bar5_size_hwtcl 12
set_instance_parameter_value pcie_a10_hip_1 pf3_class_code_hwtcl 0
set_instance_parameter_value pcie_a10_hip_1 pf3_device_id_hwtcl 0
set_instance_parameter_value pcie_a10_hip_1 pf3_exprom_bar_present_hwtcl 0
set_instance_parameter_value pcie_a10_hip_1 pf3_exprom_bar_size_hwtcl 12
set_instance_parameter_value pcie_a10_hip_1 pf3_interrupt_pin_hwtcl inta
set_instance_parameter_value pcie_a10_hip_1 pf3_intr_line_hwtcl 0
set_instance_parameter_value pcie_a10_hip_1 pf3_msi_multi_message_capable_hwtcl 4
set_instance_parameter_value pcie_a10_hip_1 pf3_msix_pba_bir_hwtcl 0
set_instance_parameter_value pcie_a10_hip_1 pf3_msix_pba_offset_hwtcl 0
set_instance_parameter_value pcie_a10_hip_1 pf3_msix_table_bir_hwtcl 0
set_instance_parameter_value pcie_a10_hip_1 pf3_msix_table_offset_hwtcl 0
set_instance_parameter_value pcie_a10_hip_1 pf3_msix_table_size_hwtcl 0
set_instance_parameter_value pcie_a10_hip_1 pf3_pci_prog_intfc_byte_hwtcl 0
set_instance_parameter_value pcie_a10_hip_1 pf3_revision_id_hwtcl 0
set_instance_parameter_value pcie_a10_hip_1 pf3_subclass_code_hwtcl 0
set_instance_parameter_value pcie_a10_hip_1 pf3_subsystem_device_id_hwtcl 0
set_instance_parameter_value pcie_a10_hip_1 pf3_subsystem_vendor_id_hwtcl 0
set_instance_parameter_value pcie_a10_hip_1 pf3_tph_dev_specific_mode_support_hwtcl 0
set_instance_parameter_value pcie_a10_hip_1 pf3_tph_int_mode_support_hwtcl 0
set_instance_parameter_value pcie_a10_hip_1 pf3_tph_st_table_location_hwtcl 0
set_instance_parameter_value pcie_a10_hip_1 pf3_tph_st_table_size_hwtcl 63
set_instance_parameter_value pcie_a10_hip_1 pf3_vendor_id_hwtcl 0
set_instance_parameter_value pcie_a10_hip_1 pf3_vf_bar0_prefetchable_hwtcl 1
set_instance_parameter_value pcie_a10_hip_1 pf3_vf_bar0_present_hwtcl 0
set_instance_parameter_value pcie_a10_hip_1 pf3_vf_bar0_size_hwtcl 12
set_instance_parameter_value pcie_a10_hip_1 pf3_vf_bar0_type_hwtcl 1
set_instance_parameter_value pcie_a10_hip_1 pf3_vf_bar1_prefetchable_hwtcl 1
set_instance_parameter_value pcie_a10_hip_1 pf3_vf_bar1_present_hwtcl 0
set_instance_parameter_value pcie_a10_hip_1 pf3_vf_bar1_size_hwtcl 12
set_instance_parameter_value pcie_a10_hip_1 pf3_vf_bar2_prefetchable_hwtcl 1
set_instance_parameter_value pcie_a10_hip_1 pf3_vf_bar2_present_hwtcl 0
set_instance_parameter_value pcie_a10_hip_1 pf3_vf_bar2_size_hwtcl 12
set_instance_parameter_value pcie_a10_hip_1 pf3_vf_bar2_type_hwtcl 1
set_instance_parameter_value pcie_a10_hip_1 pf3_vf_bar3_prefetchable_hwtcl 1
set_instance_parameter_value pcie_a10_hip_1 pf3_vf_bar3_present_hwtcl 0
set_instance_parameter_value pcie_a10_hip_1 pf3_vf_bar3_size_hwtcl 12
set_instance_parameter_value pcie_a10_hip_1 pf3_vf_bar4_prefetchable_hwtcl 1
set_instance_parameter_value pcie_a10_hip_1 pf3_vf_bar4_present_hwtcl 0
set_instance_parameter_value pcie_a10_hip_1 pf3_vf_bar4_size_hwtcl 12
set_instance_parameter_value pcie_a10_hip_1 pf3_vf_bar4_type_hwtcl 1
set_instance_parameter_value pcie_a10_hip_1 pf3_vf_bar5_prefetchable_hwtcl 1
set_instance_parameter_value pcie_a10_hip_1 pf3_vf_bar5_present_hwtcl 0
set_instance_parameter_value pcie_a10_hip_1 pf3_vf_bar5_size_hwtcl 12
set_instance_parameter_value pcie_a10_hip_1 pf3_vf_count_user_hwtcl 0
set_instance_parameter_value pcie_a10_hip_1 pf3_vf_device_id_hwtcl 0
set_instance_parameter_value pcie_a10_hip_1 pf3_vf_msix_pba_bir_hwtcl 0
set_instance_parameter_value pcie_a10_hip_1 pf3_vf_msix_pba_offset_hwtcl 0
set_instance_parameter_value pcie_a10_hip_1 pf3_vf_msix_tbl_bir_hwtcl 0
set_instance_parameter_value pcie_a10_hip_1 pf3_vf_msix_tbl_offset_hwtcl 0
set_instance_parameter_value pcie_a10_hip_1 pf3_vf_msix_tbl_size_hwtcl 0
set_instance_parameter_value pcie_a10_hip_1 pf3_vf_subsystem_device_id_hwtcl 0
set_instance_parameter_value pcie_a10_hip_1 pf3_vf_tph_dev_specific_mode_support_hwtcl 0
set_instance_parameter_value pcie_a10_hip_1 pf3_vf_tph_int_mode_support_hwtcl 0
set_instance_parameter_value pcie_a10_hip_1 pf3_vf_tph_st_table_location_hwtcl 0
set_instance_parameter_value pcie_a10_hip_1 pf3_vf_tph_st_table_size_hwtcl 63
set_instance_parameter_value pcie_a10_hip_1 pf3_virtio_capability_present_hwtcl 0
set_instance_parameter_value pcie_a10_hip_1 pf3_virtio_cmn_config_bar_indicator_hwtcl 0
set_instance_parameter_value pcie_a10_hip_1 pf3_virtio_cmn_config_bar_offset_hwtcl 0
set_instance_parameter_value pcie_a10_hip_1 pf3_virtio_cmn_config_structure_length_hwtcl 0
set_instance_parameter_value pcie_a10_hip_1 pf3_virtio_device_specific_cap_present_hwtcl 0
set_instance_parameter_value pcie_a10_hip_1 pf3_virtio_devspecific_bar_indicator_hwtcl 0
set_instance_parameter_value pcie_a10_hip_1 pf3_virtio_devspecific_bar_offset_hwtcl 0
set_instance_parameter_value pcie_a10_hip_1 pf3_virtio_devspecific_structure_length_hwtcl 0
set_instance_parameter_value pcie_a10_hip_1 pf3_virtio_isrstatus_bar_indicator_hwtcl 0
set_instance_parameter_value pcie_a10_hip_1 pf3_virtio_isrstatus_bar_offset_hwtcl 0
set_instance_parameter_value pcie_a10_hip_1 pf3_virtio_isrstatus_structure_length_hwtcl 0
set_instance_parameter_value pcie_a10_hip_1 pf3_virtio_notification_bar_indicator_hwtcl 0
set_instance_parameter_value pcie_a10_hip_1 pf3_virtio_notification_bar_offset_hwtcl 0
set_instance_parameter_value pcie_a10_hip_1 pf3_virtio_notification_structure_length_hwtcl 0
set_instance_parameter_value pcie_a10_hip_1 pf3_virtio_notify_off_multiplier_hwtcl 0
set_instance_parameter_value pcie_a10_hip_1 pf3_virtio_pciconfig_access_bar_indicator_hwtcl 0
set_instance_parameter_value pcie_a10_hip_1 pf3_virtio_pciconfig_access_bar_offset_hwtcl 0
set_instance_parameter_value pcie_a10_hip_1 pf3_virtio_pciconfig_access_structure_length_hwtcl 0
set_instance_parameter_value pcie_a10_hip_1 pf3vf_virtio_capability_present_hwtcl 0
set_instance_parameter_value pcie_a10_hip_1 pf3vf_virtio_cmn_config_bar_indicator_hwtcl 0
set_instance_parameter_value pcie_a10_hip_1 pf3vf_virtio_cmn_config_bar_offset_hwtcl 0
set_instance_parameter_value pcie_a10_hip_1 pf3vf_virtio_cmn_config_structure_length_hwtcl 0
set_instance_parameter_value pcie_a10_hip_1 pf3vf_virtio_device_specific_cap_present_hwtcl 0
set_instance_parameter_value pcie_a10_hip_1 pf3vf_virtio_devspecific_bar_indicator_hwtcl 0
set_instance_parameter_value pcie_a10_hip_1 pf3vf_virtio_devspecific_bar_offset_hwtcl 0
set_instance_parameter_value pcie_a10_hip_1 pf3vf_virtio_devspecific_structure_length_hwtcl 0
set_instance_parameter_value pcie_a10_hip_1 pf3vf_virtio_isrstatus_bar_indicator_hwtcl 0
set_instance_parameter_value pcie_a10_hip_1 pf3vf_virtio_isrstatus_bar_offset_hwtcl 0
set_instance_parameter_value pcie_a10_hip_1 pf3vf_virtio_isrstatus_structure_length_hwtcl 0
set_instance_parameter_value pcie_a10_hip_1 pf3vf_virtio_notification_bar_indicator_hwtcl 0
set_instance_parameter_value pcie_a10_hip_1 pf3vf_virtio_notification_bar_offset_hwtcl 0
set_instance_parameter_value pcie_a10_hip_1 pf3vf_virtio_notification_structure_length_hwtcl 0
set_instance_parameter_value pcie_a10_hip_1 pf3vf_virtio_notify_off_multiplier_hwtcl 0
set_instance_parameter_value pcie_a10_hip_1 pf3vf_virtio_pciconfig_access_bar_indicator_hwtcl 0
set_instance_parameter_value pcie_a10_hip_1 pf3vf_virtio_pciconfig_access_bar_offset_hwtcl 0
set_instance_parameter_value pcie_a10_hip_1 pf3vf_virtio_pciconfig_access_structure_length_hwtcl 0
set_instance_parameter_value pcie_a10_hip_1 pf4_bar0_prefetchable_hwtcl 1
set_instance_parameter_value pcie_a10_hip_1 pf4_bar0_present_hwtcl 0
set_instance_parameter_value pcie_a10_hip_1 pf4_bar0_size_hwtcl 12
set_instance_parameter_value pcie_a10_hip_1 pf4_bar0_type_hwtcl 1
set_instance_parameter_value pcie_a10_hip_1 pf4_bar1_prefetchable_hwtcl 1
set_instance_parameter_value pcie_a10_hip_1 pf4_bar1_present_hwtcl 0
set_instance_parameter_value pcie_a10_hip_1 pf4_bar1_size_hwtcl 12
set_instance_parameter_value pcie_a10_hip_1 pf4_bar2_prefetchable_hwtcl 1
set_instance_parameter_value pcie_a10_hip_1 pf4_bar2_present_hwtcl 0
set_instance_parameter_value pcie_a10_hip_1 pf4_bar2_size_hwtcl 12
set_instance_parameter_value pcie_a10_hip_1 pf4_bar2_type_hwtcl 1
set_instance_parameter_value pcie_a10_hip_1 pf4_bar3_prefetchable_hwtcl 1
set_instance_parameter_value pcie_a10_hip_1 pf4_bar3_present_hwtcl 0
set_instance_parameter_value pcie_a10_hip_1 pf4_bar3_size_hwtcl 12
set_instance_parameter_value pcie_a10_hip_1 pf4_bar4_prefetchable_hwtcl 1
set_instance_parameter_value pcie_a10_hip_1 pf4_bar4_present_hwtcl 0
set_instance_parameter_value pcie_a10_hip_1 pf4_bar4_size_hwtcl 12
set_instance_parameter_value pcie_a10_hip_1 pf4_bar4_type_hwtcl 1
set_instance_parameter_value pcie_a10_hip_1 pf4_bar5_prefetchable_hwtcl 1
set_instance_parameter_value pcie_a10_hip_1 pf4_bar5_present_hwtcl 0
set_instance_parameter_value pcie_a10_hip_1 pf4_bar5_size_hwtcl 12
set_instance_parameter_value pcie_a10_hip_1 pf4_class_code_hwtcl 0
set_instance_parameter_value pcie_a10_hip_1 pf4_device_id_hwtcl 0
set_instance_parameter_value pcie_a10_hip_1 pf4_exprom_bar_present_hwtcl 0
set_instance_parameter_value pcie_a10_hip_1 pf4_exprom_bar_size_hwtcl 12
set_instance_parameter_value pcie_a10_hip_1 pf4_interrupt_pin_hwtcl inta
set_instance_parameter_value pcie_a10_hip_1 pf4_intr_line_hwtcl 0
set_instance_parameter_value pcie_a10_hip_1 pf4_msi_multi_message_capable_hwtcl 4
set_instance_parameter_value pcie_a10_hip_1 pf4_msix_pba_bir_hwtcl 0
set_instance_parameter_value pcie_a10_hip_1 pf4_msix_pba_offset_hwtcl 0
set_instance_parameter_value pcie_a10_hip_1 pf4_msix_table_bir_hwtcl 0
set_instance_parameter_value pcie_a10_hip_1 pf4_msix_table_offset_hwtcl 0
set_instance_parameter_value pcie_a10_hip_1 pf4_msix_table_size_hwtcl 0
set_instance_parameter_value pcie_a10_hip_1 pf4_pci_prog_intfc_byte_hwtcl 0
set_instance_parameter_value pcie_a10_hip_1 pf4_revision_id_hwtcl 0
set_instance_parameter_value pcie_a10_hip_1 pf4_subclass_code_hwtcl 0
set_instance_parameter_value pcie_a10_hip_1 pf4_subsystem_device_id_hwtcl 0
set_instance_parameter_value pcie_a10_hip_1 pf4_subsystem_vendor_id_hwtcl 0
set_instance_parameter_value pcie_a10_hip_1 pf4_vendor_id_hwtcl 0
set_instance_parameter_value pcie_a10_hip_1 pf4_vf_device_id_hwtcl 0
set_instance_parameter_value pcie_a10_hip_1 pf4_vf_subsystem_device_id_hwtcl 0
set_instance_parameter_value pcie_a10_hip_1 pf4_virtio_capability_present_hwtcl 0
set_instance_parameter_value pcie_a10_hip_1 pf4_virtio_cmn_config_bar_indicator_hwtcl 0
set_instance_parameter_value pcie_a10_hip_1 pf4_virtio_cmn_config_bar_offset_hwtcl 0
set_instance_parameter_value pcie_a10_hip_1 pf4_virtio_cmn_config_structure_length_hwtcl 0
set_instance_parameter_value pcie_a10_hip_1 pf4_virtio_device_specific_cap_present_hwtcl 0
set_instance_parameter_value pcie_a10_hip_1 pf4_virtio_devspecific_bar_indicator_hwtcl 0
set_instance_parameter_value pcie_a10_hip_1 pf4_virtio_devspecific_bar_offset_hwtcl 0
set_instance_parameter_value pcie_a10_hip_1 pf4_virtio_devspecific_structure_length_hwtcl 0
set_instance_parameter_value pcie_a10_hip_1 pf4_virtio_isrstatus_bar_indicator_hwtcl 0
set_instance_parameter_value pcie_a10_hip_1 pf4_virtio_isrstatus_bar_offset_hwtcl 0
set_instance_parameter_value pcie_a10_hip_1 pf4_virtio_isrstatus_structure_length_hwtcl 0
set_instance_parameter_value pcie_a10_hip_1 pf4_virtio_notification_bar_indicator_hwtcl 0
set_instance_parameter_value pcie_a10_hip_1 pf4_virtio_notification_bar_offset_hwtcl 0
set_instance_parameter_value pcie_a10_hip_1 pf4_virtio_notification_structure_length_hwtcl 0
set_instance_parameter_value pcie_a10_hip_1 pf4_virtio_notify_off_multiplier_hwtcl 0
set_instance_parameter_value pcie_a10_hip_1 pf4_virtio_pciconfig_access_bar_indicator_hwtcl 0
set_instance_parameter_value pcie_a10_hip_1 pf4_virtio_pciconfig_access_bar_offset_hwtcl 0
set_instance_parameter_value pcie_a10_hip_1 pf4_virtio_pciconfig_access_structure_length_hwtcl 0
set_instance_parameter_value pcie_a10_hip_1 pf5_bar0_prefetchable_hwtcl 1
set_instance_parameter_value pcie_a10_hip_1 pf5_bar0_present_hwtcl 0
set_instance_parameter_value pcie_a10_hip_1 pf5_bar0_size_hwtcl 12
set_instance_parameter_value pcie_a10_hip_1 pf5_bar0_type_hwtcl 1
set_instance_parameter_value pcie_a10_hip_1 pf5_bar1_prefetchable_hwtcl 1
set_instance_parameter_value pcie_a10_hip_1 pf5_bar1_present_hwtcl 0
set_instance_parameter_value pcie_a10_hip_1 pf5_bar1_size_hwtcl 12
set_instance_parameter_value pcie_a10_hip_1 pf5_bar2_prefetchable_hwtcl 1
set_instance_parameter_value pcie_a10_hip_1 pf5_bar2_present_hwtcl 0
set_instance_parameter_value pcie_a10_hip_1 pf5_bar2_size_hwtcl 12
set_instance_parameter_value pcie_a10_hip_1 pf5_bar2_type_hwtcl 1
set_instance_parameter_value pcie_a10_hip_1 pf5_bar3_prefetchable_hwtcl 1
set_instance_parameter_value pcie_a10_hip_1 pf5_bar3_present_hwtcl 0
set_instance_parameter_value pcie_a10_hip_1 pf5_bar3_size_hwtcl 12
set_instance_parameter_value pcie_a10_hip_1 pf5_bar4_prefetchable_hwtcl 1
set_instance_parameter_value pcie_a10_hip_1 pf5_bar4_present_hwtcl 0
set_instance_parameter_value pcie_a10_hip_1 pf5_bar4_size_hwtcl 12
set_instance_parameter_value pcie_a10_hip_1 pf5_bar4_type_hwtcl 1
set_instance_parameter_value pcie_a10_hip_1 pf5_bar5_prefetchable_hwtcl 1
set_instance_parameter_value pcie_a10_hip_1 pf5_bar5_present_hwtcl 0
set_instance_parameter_value pcie_a10_hip_1 pf5_bar5_size_hwtcl 12
set_instance_parameter_value pcie_a10_hip_1 pf5_class_code_hwtcl 0
set_instance_parameter_value pcie_a10_hip_1 pf5_device_id_hwtcl 0
set_instance_parameter_value pcie_a10_hip_1 pf5_exprom_bar_present_hwtcl 0
set_instance_parameter_value pcie_a10_hip_1 pf5_exprom_bar_size_hwtcl 12
set_instance_parameter_value pcie_a10_hip_1 pf5_interrupt_pin_hwtcl inta
set_instance_parameter_value pcie_a10_hip_1 pf5_intr_line_hwtcl 0
set_instance_parameter_value pcie_a10_hip_1 pf5_msi_multi_message_capable_hwtcl 4
set_instance_parameter_value pcie_a10_hip_1 pf5_msix_pba_bir_hwtcl 0
set_instance_parameter_value pcie_a10_hip_1 pf5_msix_pba_offset_hwtcl 0
set_instance_parameter_value pcie_a10_hip_1 pf5_msix_table_bir_hwtcl 0
set_instance_parameter_value pcie_a10_hip_1 pf5_msix_table_offset_hwtcl 0
set_instance_parameter_value pcie_a10_hip_1 pf5_msix_table_size_hwtcl 0
set_instance_parameter_value pcie_a10_hip_1 pf5_pci_prog_intfc_byte_hwtcl 0
set_instance_parameter_value pcie_a10_hip_1 pf5_revision_id_hwtcl 0
set_instance_parameter_value pcie_a10_hip_1 pf5_subclass_code_hwtcl 0
set_instance_parameter_value pcie_a10_hip_1 pf5_subsystem_device_id_hwtcl 0
set_instance_parameter_value pcie_a10_hip_1 pf5_subsystem_vendor_id_hwtcl 0
set_instance_parameter_value pcie_a10_hip_1 pf5_vendor_id_hwtcl 0
set_instance_parameter_value pcie_a10_hip_1 pf5_vf_device_id_hwtcl 0
set_instance_parameter_value pcie_a10_hip_1 pf5_vf_subsystem_device_id_hwtcl 0
set_instance_parameter_value pcie_a10_hip_1 pf5_virtio_capability_present_hwtcl 0
set_instance_parameter_value pcie_a10_hip_1 pf5_virtio_cmn_config_bar_indicator_hwtcl 0
set_instance_parameter_value pcie_a10_hip_1 pf5_virtio_cmn_config_bar_offset_hwtcl 0
